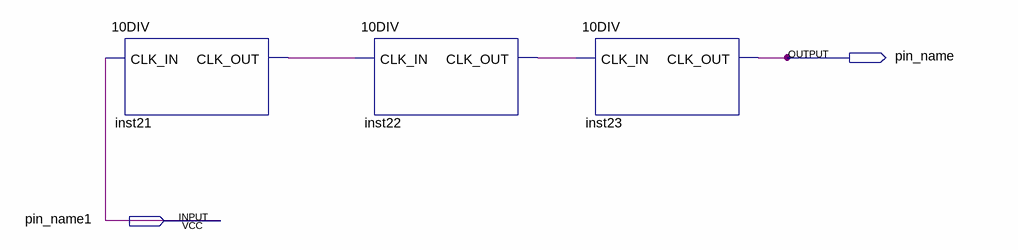
[diagram p0: schematic sheet]
// Quartus schematic 1kfenpin.bdf as structural Verilog: 3 symbols, 2 pins
module \1kfenpin  (
  input  pin_name1,
  output pin_name
);

  wire inst21_clk_out, inst22_clk_out;

  \10DIV  inst21 (.CLK_IN(pin_name1), .CLK_OUT(inst21_clk_out));
  \10DIV  inst22 (.CLK_IN(inst21_clk_out), .CLK_OUT(inst22_clk_out));
  \10DIV  inst23 (.CLK_IN(inst22_clk_out), .CLK_OUT(pin_name));
endmodule
